# EAGLE schematic scard_serial (EAGLE 6.3)
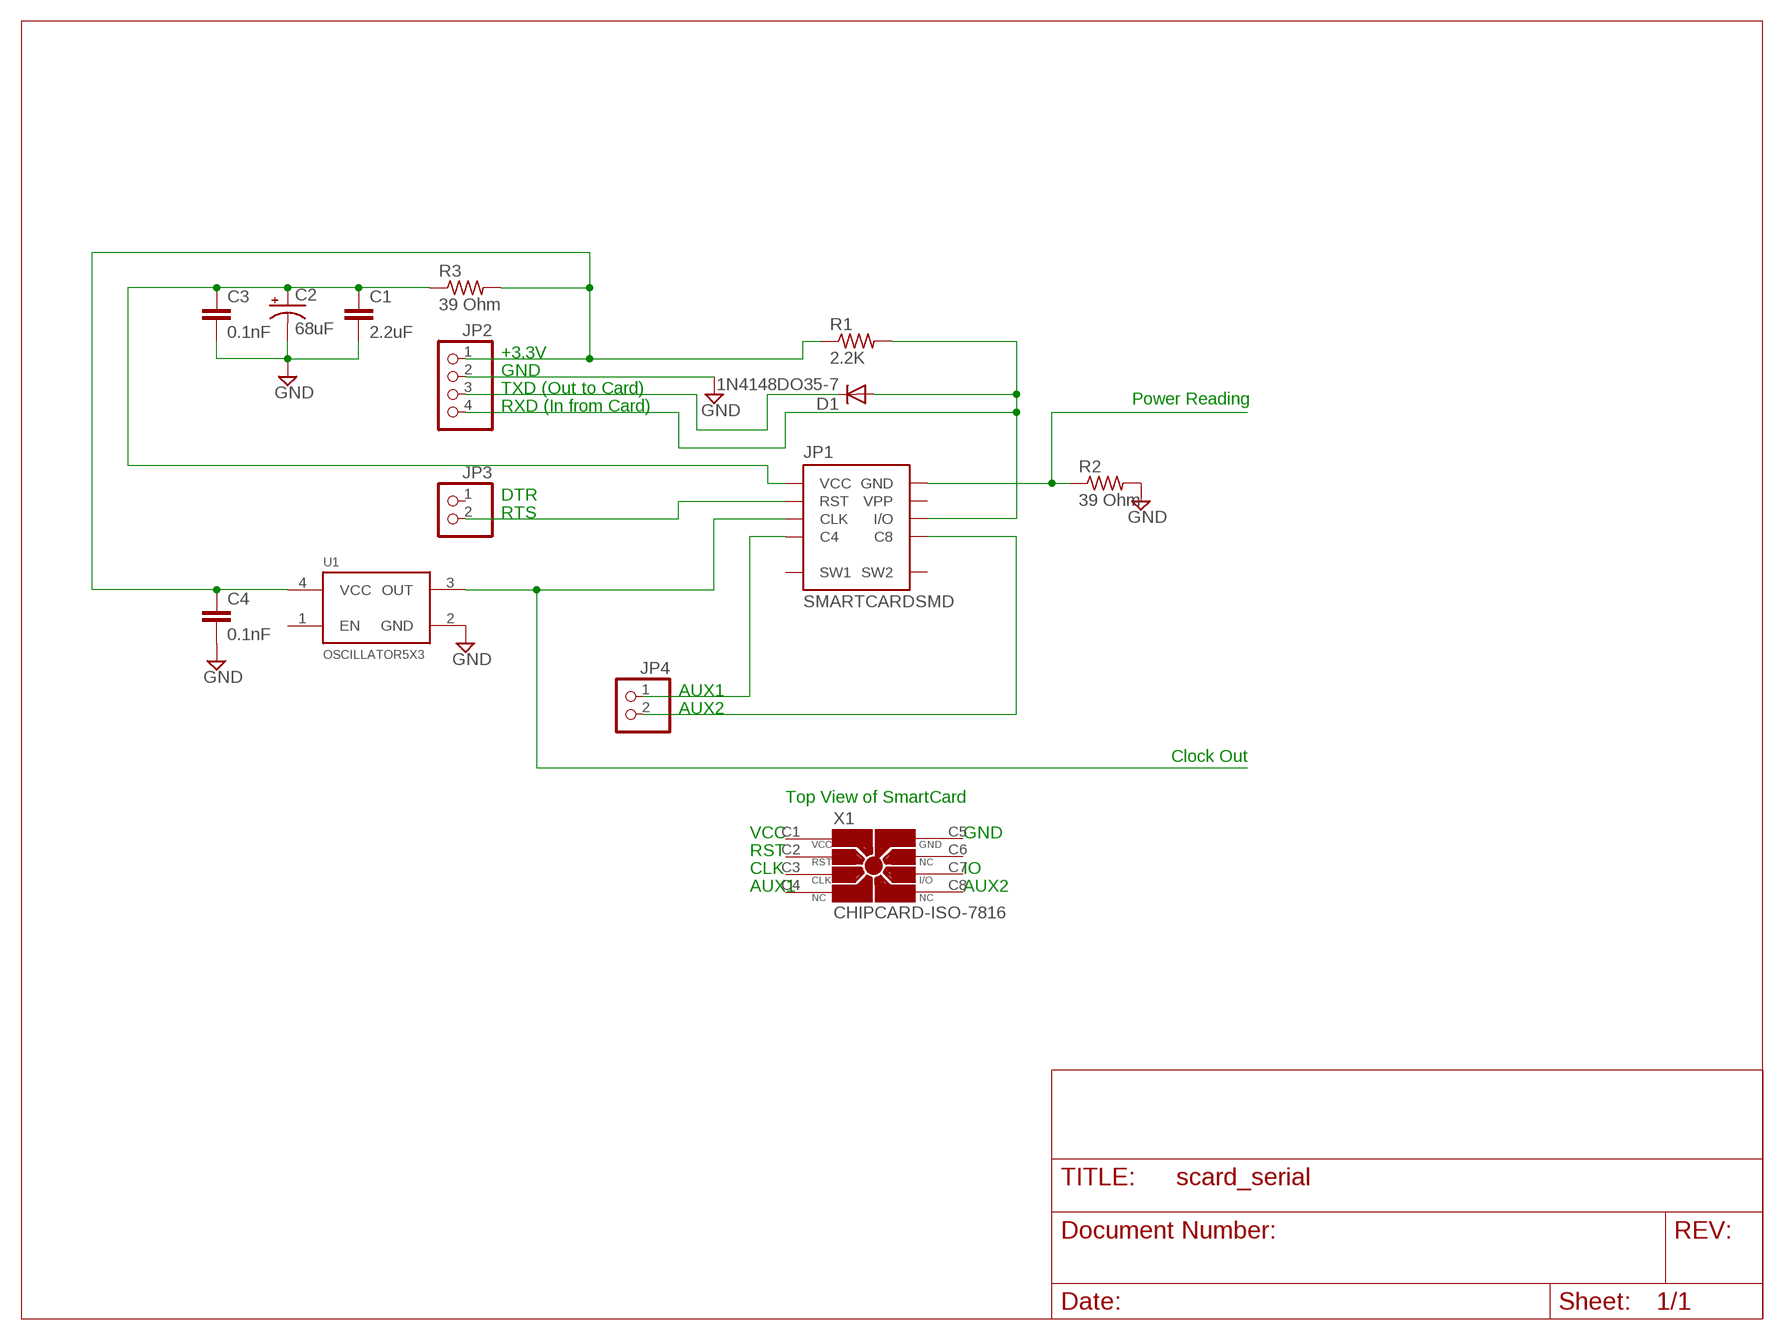
[diagram p0: schematic, sheet 1]

## Parts
C1  2.2uF  C-EUC0805  [C0805]
C2  68uF  CPOL-US139CLL-2W  [139CLL-2W]
C3  0.1nF  C-EUC0805  [C0805]
C4  0.1nF  C-EUC0805  [C0805]
D1  1N4148DO35-7  [DO35-7]
JP1  SMARTCARDSMD  [SMARTCARD]
JP2  PINHD-1X4/90  [1X04/90]
JP3  PINHD-1X2/90  [1X02/90]
JP4  PINHD-1X2/90  [1X02/90]
R1  2.2K  R-US_M0805  [M0805]
R2  39 Ohm  R-US_M0805  [M0805]
R3  39 Ohm  R-US_M0805  [M0805]
U1  OSCILLATOR5X3  [CRYSTAL-SMD-5X3]
X1  CHIPCARD-ISO-7816  [ISO7816]

## Nets
GND: C1.2 C2.- C3.2 C4.2 JP2.2 R2.2 U1.2(GND)
N$1: D1.C JP2.3
N$2: D1.A JP1.C7(I/O) JP2.4 R1.2
N$3: JP1.C3(CLK) U1.3(OUT)
N$4: C4.1 JP2.1 R1.1 R3.2 U1.4(VCC)
N$5: JP1.C2(RST) JP3.2
N$6: JP1.C4 JP4.1
N$7: JP1.C8 JP4.2
N$8: C1.1 C2.+ C3.1 JP1.C1(VCC) R3.1
N$9: JP1.C5(GND) R2.1
Unconnected: JP1.C6(VPP) JP1.P1(SW1) JP1.P2(SW2) JP3.1 U1.1(EN) X1.C1(VCC) X1.C2(RST) X1.C3(CLK) X1.C4(NC) X1.C5(GND) X1.C6(NC) X1.C7(I/O) X1.C8(NC)

## Notes on the sheet
- +3.3V
- GND
- TXD (Out to Card)
- Power Reading
- RXD (In from Card)
- DTR
- RTS
- AUX1
- AUX2
- Clock Out
- Top View of SmartCard
- VCC | GND
- RST
- CLK | IO
- AUX1 | AUX2

## Library data of the parts
C1 C3 C4 = resistor:C-EU: CAPACITOR, European symbol
C2 = rcl:CPOL-US: POLARIZED CAPACITOR, American symbol
D1 = diode:1N4148: DIODE high speed (Philips)
JP1 = SparkFun:SMARTCARD
JP2 = pinhead:PINHD-1X4: PIN HEADER
JP3 JP4 = pinhead:PINHD-1X2: PIN HEADER
R1-R3 = rcl:R-US_: RESISTOR, American symbol
U1 = SparkFun:OSCILLATOR
X1 = con-chipcard-iso7816:CHIPCARD-ISO-7816: Chip card connector ISO 7816; OC_FARNELL: unknown; OC_NEWARK: unknown